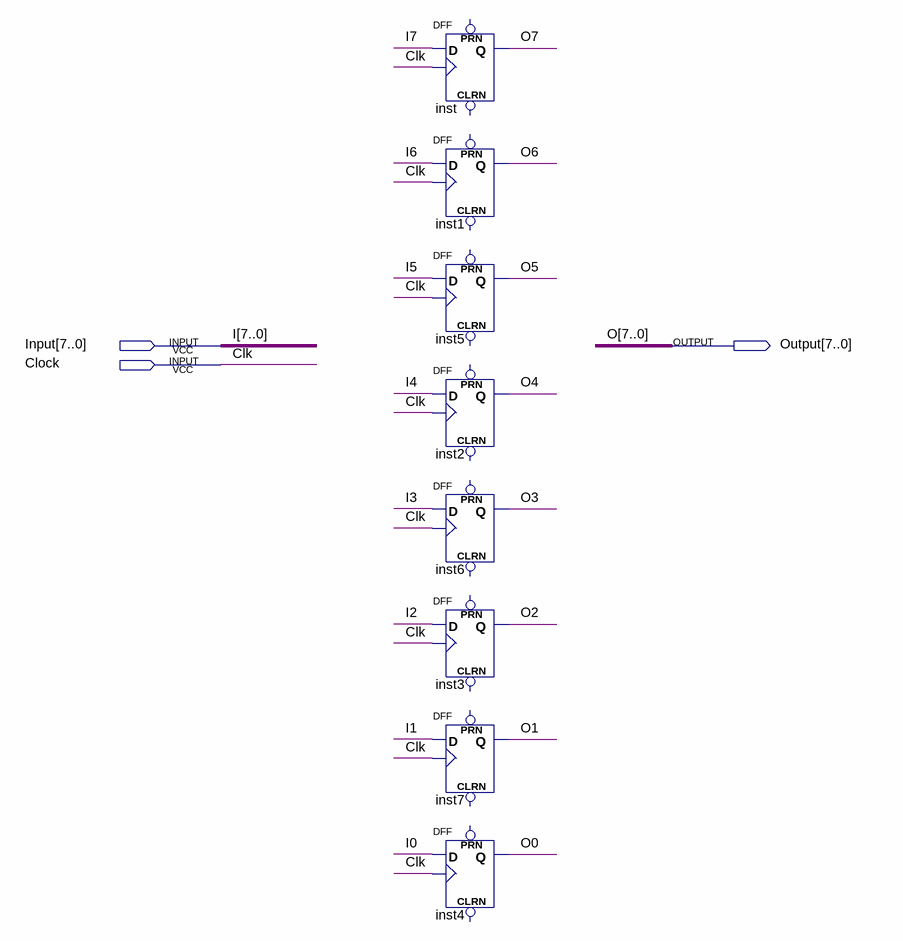
[diagram p0: schematic sheet]
// Quartus schematic PC.bdf as structural Verilog: 8 symbols, 3 pins
module PC (
  input  [7:0] Input,
  input  Clock,
  output [7:0] Output
);

  DFF inst (.CLK(Clock), .D(Input[7]), .Q(Output[7]));  // open: CLRN, PRN
  DFF inst1 (.CLK(Clock), .D(Input[6]), .Q(Output[6]));  // open: CLRN, PRN
  DFF inst5 (.CLK(Clock), .D(Input[5]), .Q(Output[5]));  // open: CLRN, PRN
  DFF inst2 (.CLK(Clock), .D(Input[4]), .Q(Output[4]));  // open: CLRN, PRN
  DFF inst6 (.CLK(Clock), .D(Input[3]), .Q(Output[3]));  // open: CLRN, PRN
  DFF inst3 (.CLK(Clock), .D(Input[2]), .Q(Output[2]));  // open: CLRN, PRN
  DFF inst7 (.CLK(Clock), .D(Input[1]), .Q(Output[1]));  // open: CLRN, PRN
  DFF inst4 (.CLK(Clock), .D(Input[0]), .Q(Output[0]));  // open: CLRN, PRN

  // Other names for the same wires on the sheet: Clk = Clock; I[7:0] = Input; I0 = Input[0]; I1 = Input[1];
  //   I2 = Input[2]; I3 = Input[3]; I4 = Input[4]; I5 = Input[5]; I6 = Input[6]; I7 = Input[7]; O[7:0] = Output;
  //   O0 = Output[0]; O1 = Output[1]; O2 = Output[2]; O3 = Output[3]; O4 = Output[4]; O5 = Output[5]; O6 = Output[6];
  //   O7 = Output[7]
endmodule
